# EAGLE design expansion_board (EAGLE 6.6.0)
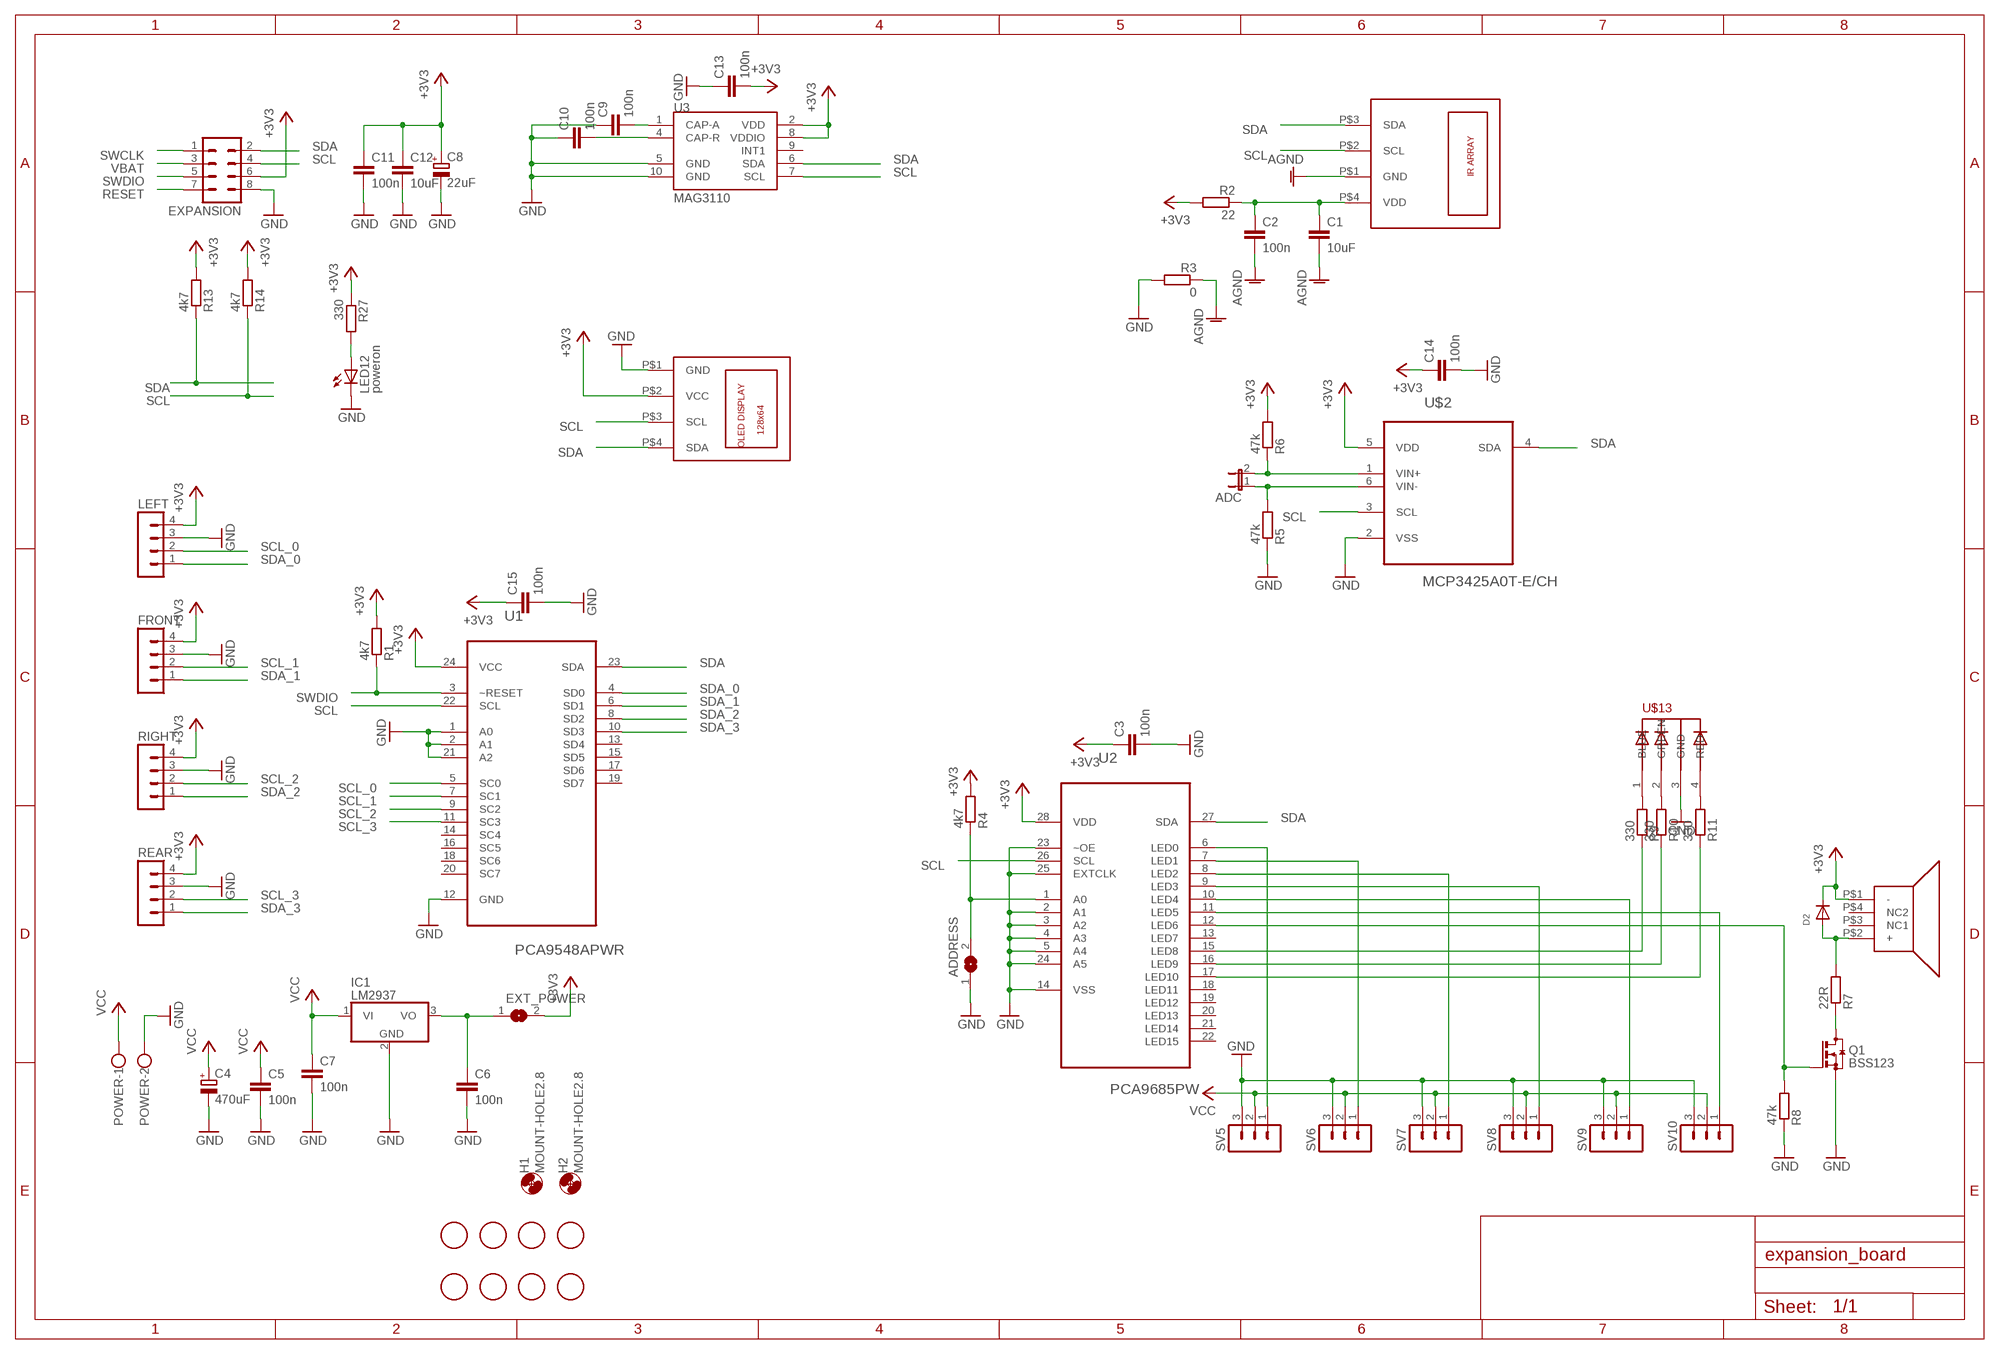
[diagram p0: schematic, sheet 1]

## Parts
ADC  JP1E  [JP1]
ADDRESS  SJ  [SJ]
C1  10uF  C-EUC0805  [C0805]
C2  100n  C-EUC0805  [C0805]
C3  100n  C-EUC0805  [C0805]
C4  470uF  CPOL-EU153CLV-1012  [153CLV-1012]
C5  100n  C-EUC0805  [C0805]
C6  100n  C-EUC0805  [C0805]
C7  100n  C-EUC0805  [C0805]
C8  22uF  CPOL-EU153CLV-0505  [153CLV-0505]
C9  100n  C-EUC0805  [C0805]
C10  100n  C-EUC0805  [C0805]
C11  100n  C-EUC0805  [C0805]
C12  10uF  C-EUC0805  [C0805]
C13  100n  C-EUC0805  [C0805]
C14  100n  C-EUC0805  [C0805]
C15  100n  C-EUC0805  [C0805]
D2  DIODE_SOD-123FL  [SOD-123FL]
EXPANSION  MA04-2  [MA04-2]
EXT_POWER  SJ  [SJ]
FRONT  MA04-1  [MA04-1]
H1  MOUNT-HOLE2.8  [2,8]
H2  MOUNT-HOLE2.8  [2,8]
IC1  LM2937  [TO263-3]
LED12  poweron  LEDCHIPLED_1206  [CHIPLED_1206]
LEFT  MA04-1  [MA04-1]
POWER  W237-102  [W237-102]
Q1  BSS123  [SOT23]
R1  4k7  R-EU_M0805  [M0805]
R2  22  R-EU_M0805  [M0805]
R3  0  R-EU_M0805  [M0805]
R4  4k7  R-EU_M0805  [M0805]
R5  47k  R-EU_M0805  [M0805]
R6  47k  R-EU_M0805  [M0805]
R7  22R  R-EU_M0805  [M0805]
R8  47k  R-EU_M0805  [M0805]
R9  330  R-EU_M0805  [M0805]
R10  330  R-EU_M0805  [M0805]
R11  330  R-EU_M0805  [M0805]
R13  4k7  R-EU_M0805  [M0805]
R14  4k7  R-EU_M0805  [M0805]
R27  330  R-EU_M0805  [M0805]
REAR  MA04-1  [MA04-1]
RIGHT  MA04-1  [MA04-1]
SV5  MA03-1  [MA03-1]
SV6  MA03-1  [MA03-1]
SV7  MA03-1  [MA03-1]
SV8  MA03-1  [MA03-1]
SV9  MA03-1  [MA03-1]
SV10  MA03-1  [MA03-1]
U1  PCA9548APWR  [SOP65P640X120-24N]
U2  PCA9685PW  [SOP65P640X110-28N]
U3  MAG3110  [DFN-10]
U$1  MLX90621  [MLX90621]
U$2  MCP3425A0T-E/CH  [SOT95P270X145-6N]
U$3  SPEAKER_KAAG15008C  [KAAG15008C]
U$4  OLED_DISPLAY_096_INCH  [OLED_DISPLAY_096_INCH]
U$5  FIDUCIAL  [FIDUCIAL_1MM]
U$6  FIDUCIAL  [FIDUCIAL_1MM]
U$7  FIDUCIAL  [FIDUCIAL_1MM]
U$8  FIDUCIAL  [FIDUCIAL_1MM]
U$9  FIDUCIAL  [FIDUCIAL_1MM]
U$10  FIDUCIAL  [FIDUCIAL_1MM]
U$11  FIDUCIAL  [FIDUCIAL_1MM]
U$12  FIDUCIAL  [FIDUCIAL_1MM]
U$13  5MMRGBLED  [LED5MMRGB]

## Nets
+3V3: C3.1 C8.+ C11.1 C12.1 C13.2 C14.1 C15.1 D2.C EXPANSION.6 EXT_POWER.2 FRONT.4 LEFT.4 R1.2 R2.2 R4.2 R6.2 R13.2 R14.2 R27.1 REAR.4 RIGHT.4 U1.24(VCC) U2.28(VDD) U3.2(VDD) U3.8(VDDIO) U$2.5(VDD) U$3.P$1(-) U$4.P$2(VCC)
AGND: C1.2 C2.2 R3.1 U$1.P$1(GND)
GND: ADDRESS.1 C3.2 C4.- C5.2 C6.2 C7.2 C8.- C9.1 C10.1 C11.2 C12.2 C13.1 C14.2 C15.2 EXPANSION.8 FRONT.3 IC1.2(GND) LED12.C LEFT.3 POWER.2 Q1.2(S) R3.2 R5.1 R8.1 REAR.3 RIGHT.3 SV5.3 SV6.3 SV7.3 SV8.3 SV9.3 SV10.3 U1.1(A0) U1.2(A1) U1.12(GND) U1.21(A2) U2.2(A1) U2.3(A2) U2.4(A3) U2.5(A4) U2.14(VSS) U2.23(~OE) U2.24(A5) U2.25(EXTCLK) U3.5(GND) U3.10(GND) U$2.2(VSS) U$4.P$1(GND) U$13.3(GND)
N$1: C1.1 C2.1 R2.1 U$1.P$4(VDD)
N$2: SV5.1 U2.6(LED0)
N$3: SV6.1 U2.7(LED1)
N$4: SV7.1 U2.8(LED2)
N$5: SV8.1 U2.9(LED3)
N$6: SV9.1 U2.10(LED4)
N$7: SV10.1 U2.11(LED5)
N$8: C6.1 EXT_POWER.1 IC1.3(VO)
N$9: ADDRESS.2 R4.1 U2.1(A0)
N$13: C9.2 U3.1(CAP-A)
N$14: C10.2 U3.4(CAP-R)
N$15: ADC.1 R5.2 U$2.6(VIN-)
N$16: ADC.2 R6.1 U$2.1(VIN+)
N$17: R9.2 U$13.1(BLUE)
N$18: Q1.1(G) R8.2 U2.12(LED6)
N$19: Q1.3(D) R7.1
N$20: D2.A R7.2 U$3.P$2(+)
N$21: R11.2 U$13.4(RED)
N$22: R10.2 U$13.2(GREEN)
N$23: LED12.A R27.2
N$24: R9.1 U2.15(LED8)
N$25: R10.1 U2.16(LED9)
N$26: R11.1 U2.17(LED10)
RESET: EXPANSION.7
SCL: EXPANSION.4 R14.1 U1.22(SCL) U2.26(SCL) U3.7(SCL) U$1.P$2(SCL) U$2.3(SCL) U$4.P$3(SCL)
SCL_0: LEFT.2 U1.5(SC0)
SCL_1: FRONT.2 U1.7(SC1)
SCL_2: RIGHT.2 U1.9(SC2)
SCL_3: REAR.2 U1.11(SC3)
SDA: EXPANSION.2 R13.1 U1.23(SDA) U2.27(SDA) U3.6(SDA) U$1.P$3(SDA) U$2.4(SDA) U$4.P$4(SDA)
SDA_0: LEFT.1 U1.4(SD0)
SDA_1: FRONT.1 U1.6(SD1)
SDA_2: RIGHT.1 U1.8(SD2)
SDA_3: REAR.1 U1.10(SD3)
SWCLK: EXPANSION.1
SWDIO: EXPANSION.5 R1.1 U1.3(~RESET)
VBAT: EXPANSION.3
VCC: C4.+ C5.1 C7.1 IC1.1(VI) POWER.1 SV5.2 SV6.2 SV7.2 SV8.2 SV9.2 SV10.2
Unconnected: U1.13(SD4) U1.14(SC4) U1.15(SD5) U1.16(SC5) U1.17(SD6) U1.18(SC6) U1.19(SD7) U1.20(SC7) U2.13(LED7) U2.18(LED11) U2.19(LED12) U2.20(LED13) U2.21(LED14) U2.22(LED15) U3.9(INT1) U$3.P$3(NC1) U$3.P$4(NC2)

## Library data of the parts
ADC = jumper:JP1E: JUMPER
ADDRESS EXT_POWER = jumper:SJ: SMD solder JUMPER
C1-C3 C5-C7 C9-C15 = resistor:C-EU: CAPACITOR, European symbol
C4 C8 = resistor:CPOL-EU: POLARIZED CAPACITOR, European symbol
D2 = adafruit:DIODE: Diode SMADIODE - SMA Surface Mount Package 20V 1A Schottky Diode Digikey: 641-1014-6-ND DO-1N4148 - Through Hole Small Current Diode SOD-123 20V 1 A (.5mV Vf) Schottky Diode - Digikey: MBRX120TPMSCT-ND SOD-323 10V 570mA (.38mV Vf, 3ns) Schottky Diode - Digikey: ZLLS410CT-ND SOD-523 30V 30mA Schottky Diode (RB751S-40TE61) - Digikey: RB751S-40TE61CT-ND SOT23-R/W - SOT23 Package (R = Solder Paste/Reflow Ovens, W = Hand-Soldering) BAT54Film 40V 300mA - Digikey: 497-7162-1-ND
EXPANSION = con-lstb:MA04-2: PIN HEADER; OC_FARNELL: unknown; OC_NEWARK: unknown
FRONT LEFT REAR RIGHT = con-lstb:MA04-1: PIN HEADER; OC_FARNELL: unknown; OC_NEWARK: unknown
H1 H2 = holes:MOUNT-HOLE: MOUNTING HOLE with drill center marker
IC1 = linear:LM2937: LM2937-2.5, LM2937-3.3 400mA and 500mA Voltage Regulators Source: http://cache.national.com/ds/LM/LM2937-2.5.pdf
LED12 = led:LED: LED OSRAM: - CHIPLED LG R971, LG N971, LY N971, LG Q971, LY Q971, LO R971, LY R971 LH N974, LH R974 LS Q976, LO Q976, LY Q976 LO Q996 - Hyper CHIPLED LW Q18S LB Q993, LB Q99A, LB R99A - SideLED LS A670, LO A670, LY A670, LG A670, LP A670 LB A673, LV A673, LT A673, LW A673 LH A674 LY A675 LS A676, LA A676, LO A676, LY A676, LW A676 LS A679, LY A679, LG A679 - Hyper Micro SIDELED® LS Y876, LA Y876, LO Y876, LY Y876 LT Y87S - SmartLED LW L88C, LW L88S LB L89C, LB L89S, LG L890 LS L89K, LO L89K, LY L89K LS L896, LA L896, LO L896, LY L896 - TOPLED LS T670, LO T670, LY T670, LG T670, LP T670 LSG T670, LSP T670, LSY T670, LOP T670, LYG T670 LG T671, LOG T671, LSG T671 LB T673, LV T673, LT T673, LW T673 LH T674 LS T676, LA T676, LO T676, LY T676, LB T676, LH T676, LSB T676, LW T676 LB T67C, LV T67C, LT T67C, LS T67K, LO T67K, LY T67K, LW E67C LS E67B, LA E67B, LO E67B, LY E67B, LB E67C, LV E67C, LT E67C LW T67C LS T679, LY T679, LG T679 LS T770, LO T770, LY T770, LG T770, LP T770 LB T773, LV T773, LT T773, LW T773 LH T774 LS E675, LA E675, LY E675, LS T675 LS T776, LA T776, LO T776, LY T776, LB T776 LHGB T686 LT T68C, LB T68C - Hyper Mini TOPLED® LB M676 - Mini TOPLED Santana® LG M470 LS M47K, LO M47K, LY M47K Source: http://www.osram.convergy.de LUXEON: - LUMILED® LXK2-PW12-R00, LXK2-PW12-S00, LXK2-PW14-U00, LXK2-PW14-V00 LXK2-PM12-R00, LXK2-PM12-S00, LXK2-PM14-U00 LXK2-PE12-Q00, LXK2-PE12-R00, LXK2-PE12-S00, LXK2-PE14-T00, LXK2-PE14-U00 LXK2-PB12-K00, LXK2-PB12-L00, LXK2-PB12-M00, LXK2-PB14-N00, LXK2-PB14-P00, LXK2-PB14-Q00 LXK2-PR12-L00, LXK2-PR12-M00, LXK2-PR14-Q00, LXK2-PR14-R00 LXK2-PD12-Q00, LXK2-PD12-R00, LXK2-PD12-S00 LXK2-PH12-R00, LXK2-PH12-S00 LXK2-PL12-P00, LXK2-PL12-Q00, LXK2-PL12-R00 Source: www.luxeon.com KINGBRIGHT: KA-3528ASYC Source: www.kingbright.com
POWER = con-wago-500:W237-102: WAGO SCREW CLAMP; MPN: 237-102; OC_FARNELL: unknown; OC_NEWARK: 70K9898
Q1 = transistor-small-signal:BSS123: N-CHANNEL MOS FET
R1-R11 R13 R14 R27 = resistor:R-EU_: RESISTOR, European symbol
SV5-SV10 = con-lstb:MA03-1: PIN HEADER; OC_FARNELL: unknown; OC_NEWARK: unknown
U1 = my_parts:PCA9548APWR: 8-CHANNEL I2C SWITCH WITH RESET; MPN: PCA9548APWR False; OC_FARNELL: 1607855; OC_NEWARK: 22M1602; PACKAGE: TSSOP-24; SUPPLIER: Texas Instruments
U2 = my_parts:PCA9685PW: 16-channel, 12-bit PWM Fm+ I2C-bus LED controller; MPN: PCA9685PW; OC_FARNELL: 1854074; OC_NEWARK: 19T6398; PACKAGE: TSSOP-28; SUPPLIER: NXP
U3 = SparkFun-Sensors:MAG3110: 3-axis digital (I2C) magnetometer
U$1 = my_parts:MLX90621
U$2 = my_parts:MCP3425A0T-E/CH: Analog-to-Digital Converter; MPN: MCP3425A0T-E/CH; OC_FARNELL: 1578433; OC_NEWARK: 88M9948; PACKAGE: SOT-6; SUPPLIER: Microchip
U$3 = my_parts:SPEAKER_KAAG15008C
U$4 = my_parts:OLED_DISPLAY_096_INCH
U$5-U$12 = adafruit:FIDUCIAL: For use by pick and place machines to calibrate the vision/machine, 1mm By microbuilder.eu
U$13 = adafruit:5MMRGBLED

## Board
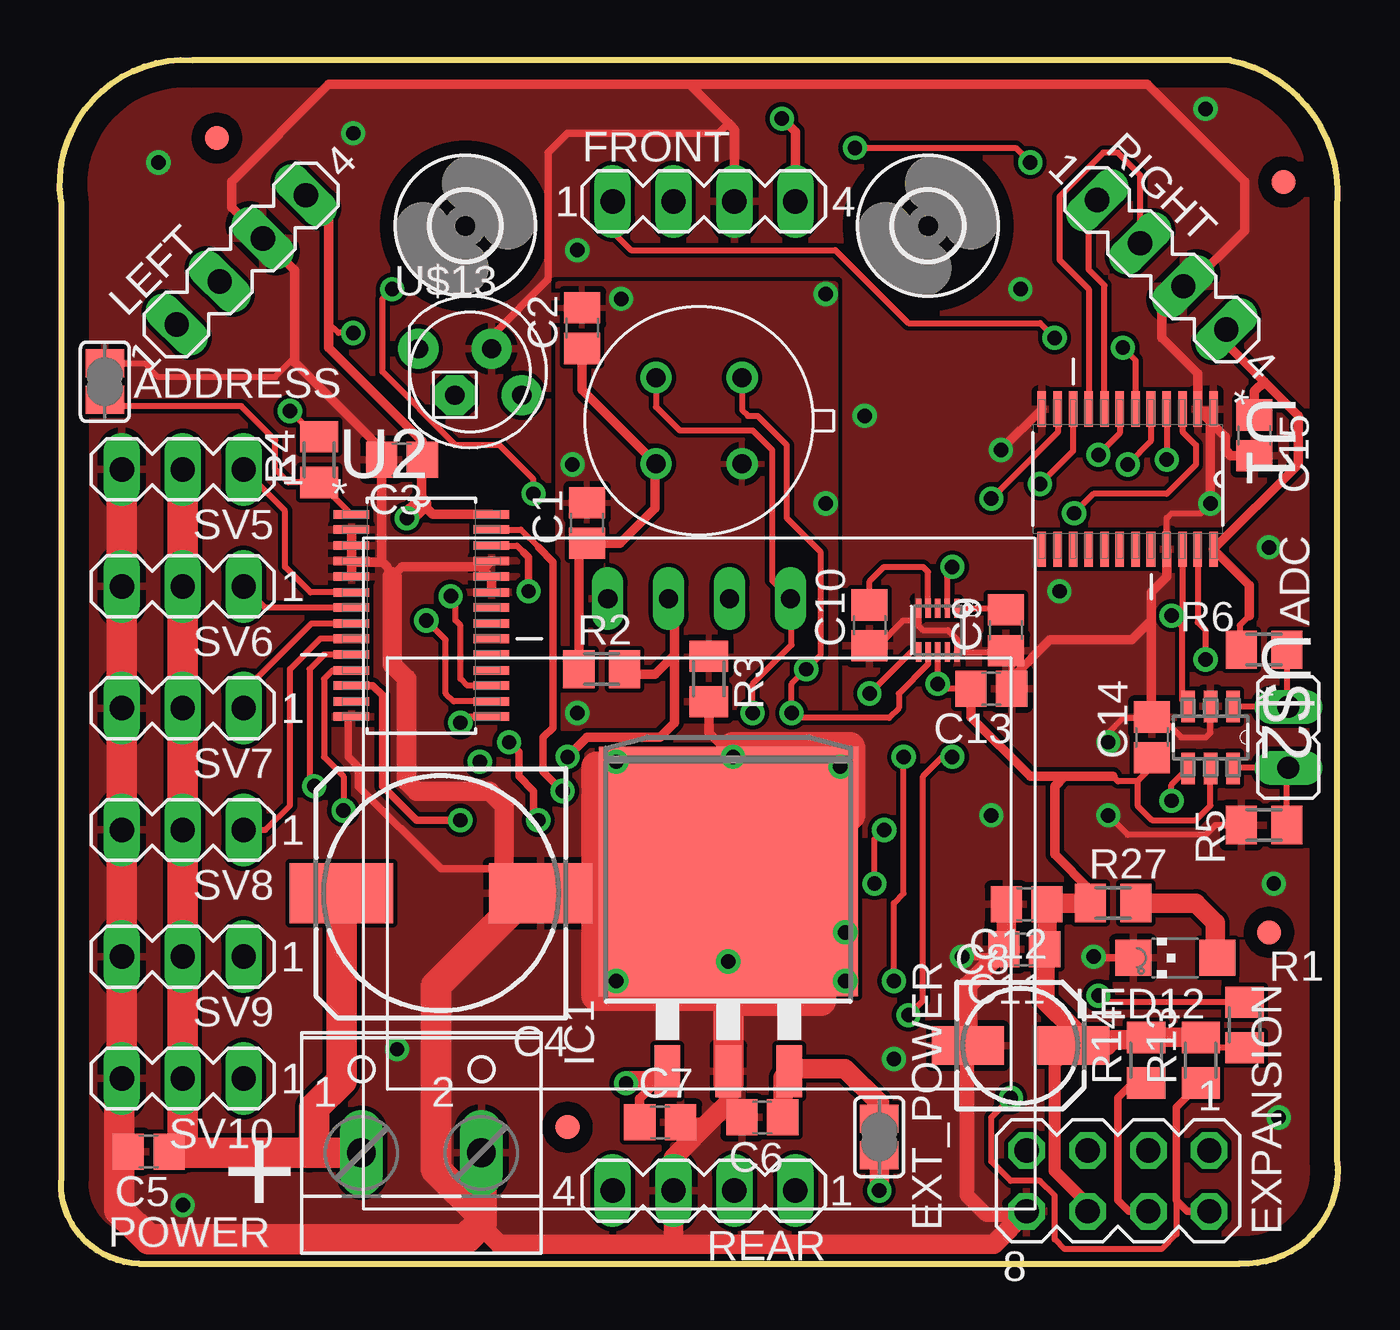
[diagram p1: board, top side]
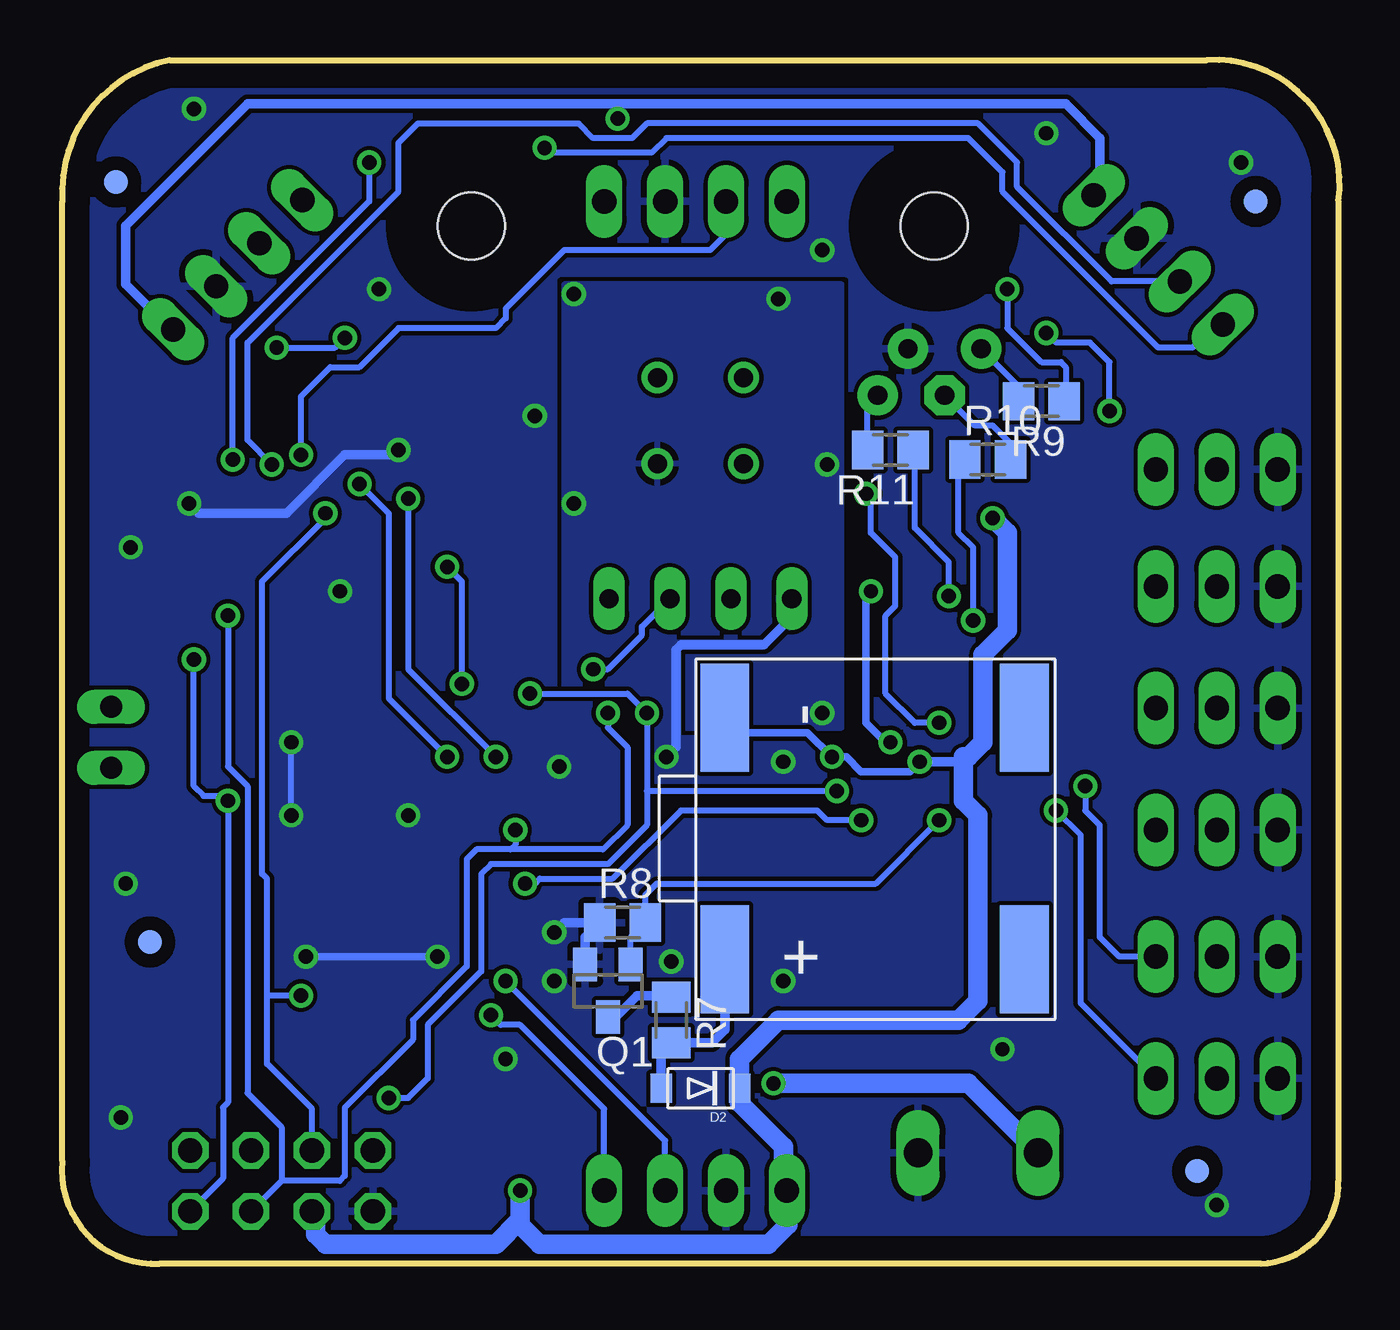
[diagram p2: board, bottom side, seen from below]

Size 53.3 x 50.2 mm. Coordinates in mm from the lower left corner, seen from the top.
Outline: 3.29,0 49.22,0 arc99 53.28,4.27 53.28,44.3 arc82 48.81,50.19 5.53,50.19 arc101 0.04,44.3 0.04,3.46 arc90 3.29,0
Copper layers (1*16): Top 0.035mm / dielectric 1.5mm / Bottom 0.035mm
Design rules "default *": minimum track width 7mil, minimum drill 24mil, track to track 7mil, track to pad 7mil, pad to pad 7mil, via to via 7mil, smd to smd 7mil, copper to edge 40mil, drill to drill 8mil, minimum pad ring 10mil, minimum via ring 8mil, stop-mask expansion 4mil, vias tented up to drill 0mil, thermal gap 10mil

### Footprints (pad centres in the part's own frame; a part is rotated, then mirrored left to right if it is on the bottom)
JP1 = drill 0.914 long: 1 0,-1.27; 2 0,1.27
SJ = smd 1.168 x 1.6: 1 -0.762,0; 2 0.762,0
C0805 = smd 1.3 x 1.5: 1 -0.85,0; 2 0.85,0
153CLV-1012 = smd 4.3 x 2.5: + 4.15,0; - -4.15,0
153CLV-0505 = smd 3 x 1.6: + 2.2,0; - -2.2,0
SOD-123FL = smd 0.91 x 1.22: A 1.637,0; C -1.637,0
MA04-2 = drill 1.016 octagon: 1 -3.81,-1.27; 2 -3.81,1.27; 3 -1.27,-1.27; 4 -1.27,1.27; 5 1.27,-1.27; 6 1.27,1.27; 7 3.81,-1.27; 8 3.81,1.27
MA04-1 = drill 1.016 long: 1 -3.81,0; 2 -1.27,0; 3 1.27,0; 4 3.81,0
2,8 = hole 2.8: 0,0
TO263-3 = smd 1.067 x 2.159: 1 -2.54,-5.791; 2 0,-5.791; 3 2.54,-5.791 | smd 10.8 x 10.41: TAB 0,2.54
CHIPLED_1206 = smd 1.5 x 1.5: A 0,-1.75; C 0,1.75
W237-102 = drill 1.194 long: 1 -2.5,-1.27; 2 2.5,-1.27
SOT23 = smd 1 x 1.4: 1 -0.95,-1.1; 2 0.95,-1.1; 3 0,1.1
M0805 = smd 1.3 x 1.6: 1 -0.95,0; 2 0.95,0
MA03-1 = drill 1.016 long: 1 -2.54,0; 2 0,0; 3 2.54,0
SOP65P640X120-24N = smd 1.473 x 0.356: 1 -2.921,3.581; 2 -2.921,2.921; 3 -2.921,2.286; 4 -2.921,1.626; 5 -2.921,0.965; 6 -2.921,0.33; 7 -2.921,-0.33; 8 -2.921,-0.965; 9 -2.921,-1.626; 10 -2.921,-2.286; 11 -2.921,-2.921; 12 -2.921,-3.581; 13 2.921,-3.581; 14 2.921,-2.921; 15 2.921,-2.286; 16 2.921,-1.626; 17 2.921,-0.965; 18 2.921,-0.33; 19 2.921,0.33; 20 2.921,0.965; 21 2.921,1.626; 22 2.921,2.286; 23 2.921,2.921; 24 2.921,3.581
SOP65P640X110-28N = smd 1.473 x 0.356: 1 -2.921,4.216; 2 -2.921,3.581; 3 -2.921,2.921; 4 -2.921,2.286; 5 -2.921,1.626; 6 -2.921,0.965; 7 -2.921,0.33; 8 -2.921,-0.33; 9 -2.921,-0.965; 10 -2.921,-1.626; 11 -2.921,-2.286; 12 -2.921,-2.921; 13 -2.921,-3.581; 14 -2.921,-4.216; 15 2.921,-4.216; 16 2.921,-3.581; 17 2.921,-2.921; 18 2.921,-2.286; 19 2.921,-1.626; 20 2.921,-0.965; 21 2.921,-0.33; 22 2.921,0.33; 23 2.921,0.965; 24 2.921,1.626; 25 2.921,2.286; 26 2.921,2.921; 27 2.921,3.581; 28 2.921,4.216
DFN-10 = smd 0.8 x 0.22: 1 -0.91,0.8; 2 -0.91,0.4; 3 -0.91,0; 4 -0.91,-0.4; 5 -0.91,-0.8; 6 0.91,-0.8; 7 0.91,-0.4; 8 0.91,0; 9 0.91,0.4; 10 0.91,0.8
MLX90621 = drill 0.8: P$1 2.54,0; P$2 0,2.54; P$3 -2.54,0; P$4 0,-2.54
SOT95P270X145-6N = smd 1.321 x 0.559: 1 -1.295,0.94; 2 -1.295,0; 3 -1.295,-0.94; 4 1.295,-0.94; 5 1.295,0; 6 1.295,0.94
KAAG15008C = smd 4.5 x 2.037: P$1 2.438,1.219; P$2 12.497,1.219; P$3 12.497,13.716; P$4 2.438,13.716
OLED_DISPLAY_096_INCH = drill 0.8 long: P$1 -3.81,10.46; P$2 -1.27,10.46; P$3 1.27,10.46; P$4 3.81,10.46
FIDUCIAL_1MM = smd 1 x 1: 1 0,0
LED5MMRGB = drill 0.8 pad 1.676: 1 -2.159,0.968; 3 0.889,0.968; 4 2.159,-0.968 | drill 0.8 pad 1.676 octagon: 2 -0.635,-0.968

### Placement (x,y rotation side)
ADC  51.25,21.95 0 top
ADDRESS  1.87,36.78 270 top
C1  21.99,30.89 90 top
C2  21.79,39.02 90 top
C3  14.27,33.53 180 top
C4  15.89,15.45 180 top
C5  3.7,4.68 180 top
C6  29.3,6.1 180 top
C7  25.04,5.9 0 top
C8  40.07,9.1 0 top
C9  39.46,26.42 90 top
C10  33.78,26.62 90 top
C11  40.23,13.11 180 top
C12  40.33,14.99 180 top
C13  38.86,23.98 180 top
C14  45.56,21.95 90 top
C15  49.83,34.55 270 top
D2  26.66,7.32 180 bottom
EXPANSION  44.14,3.46 180 top
EXT_POWER  34.18,5.29 270 top
FRONT  26.87,44.3 0 top
H1  36.21,43.28 0 top
H2  16.91,43.28 0 top
IC1  27.88,13.82 0 top
LED12  46.53,12.75 90 top
LEFT  7.56,41.86 45 top
POWER  15.08,5.9 0 top
Q1  30.52,11.38 180 bottom
R1  49.42,9.96 270 top
R2  22.6,24.79 0 top
R3  27.07,24.39 270 top
R4  10.81,33.53 90 top
R5  50.23,18.29 0 top
R6  50.23,25.61 180 top
R7  27.88,10.16 270 bottom
R8  29.91,14.23 0 bottom
R9  12.44,35.97 180 bottom
R10  14.67,33.53 0 bottom
R11  18.74,33.94 180 bottom
R13  47.59,8.49 90 top
R14  45.31,8.49 90 top
R27  43.94,15.04 0 top
REAR  26.87,3.05 180 top
RIGHT  45.97,41.66 315 top
SV5  5.12,33.12 180 top
SV6  5.12,28.25 180 top
SV7  5.12,23.17 180 top
SV8  5.12,18.09 180 top
SV9  5.12,12.8 180 top
SV10  5.12,7.72 180 top
U1  44.54,32.72 270 top
U2  15.08,27.03 0 top
U3  36.62,26.42 270 top
U$1  26.66,35.16 315 top
U$2  48,21.95 270 top
U$3  26.87,25.2 270 bottom
U$4  26.66,17.27 0 top
U$5  21.18,5.69 0 top
U$6  6.55,46.94 0 top
U$7  50.44,13.82 0 top
U$8  51.05,45.11 0 top
U$9  51.05,45.11 0 bottom
U$10  3.5,44.3 0 bottom
U$11  49.62,13.41 0 bottom
U$12  5.94,3.86 0 bottom
U$13  17.11,37.19 0 top

### Tracks (layer width: path | path; a pad name or v marks a point on that pad's centre or on a via)
+3V3  (via drill 0.6)
  Top 0.254: R4.2 10.68,34.48 v9.59,35.56 | 48,21.14 U$2.5 48,19.1 47.39,18.49 45.56,18.49 44.95,19.1 44.95,20.12 | 49.62,27.03 49.22,26.62 49.22,25.67 R6.2 | U3.2 37.02,28.85 v37.23,29.06 | U3.8 v36.62,24.18 36.82,23.98 C13.2 | R1.2 48.02,9.01 R13.2 | C14.1 45.56,20.73 44.95,20.12 | 44.95,20.12 44.14,20.12 43.93,20.32 | v12.24,38.81 11.63,38.81 11.22,39.22
  Top 0.406: U2.28 15.54,31.24 15.08,31.7 15.08,33.49 C3.1 15.12,34.31 11.22,38.2 11.22,39.22 11.22,43.59 LEFT.4 | v21.18,21.14 21.99,21.95 25.04,21.95 25.65,22.56 25.65,25.4 | FRONT.4 30.68,47.2 v30.12,47.75 | 49.62,27.03 49.62,28.3 U1.24 51.66,33.33 51.66,35.36 50.23,36.78 | RIGHT.4 48.66,38.35 50.23,36.78 | C15.1 49.83,36.38 50.23,36.78 | C13.2 38,22.8 40.48,20.32 41.9,20.32 | 43.93,20.32 41.9,20.32 | R27.1 42.98,15.58 41.5,17.07 41.5,19.92 41.9,20.32 | 25.65,25.4 25.65,27.48 U$4.P$2 | 25.65,25.4 24.83,24.59 23.75,24.59 R2.2
  Top 0.508: EXPANSION.6 42.87,2.49 41.5,3.86 41.5,8.32 C8.+
  Top 0.813: R13.2 R14.2 45.22,9.35 43.93,9.35 43.68,9.1 C8.+ 42.27,9.79 41.09,10.98 41.09,13.1 C11.1 41.18,13.21 C12.1 41.23,15.04 R27.1 | v34.18,3.05 EXT_POWER.2 | v14.47,31.09 15.08,31.7
  Bottom 0.254: v37.23,29.06 36.62,28.45 v36.62,24.18 | v9.59,35.56 9.59,37.59 10.41,38.41 11.83,38.41 v12.24,38.81
  Bottom 0.305: v17.52,20.93 17.93,20.53 19.96,20.53 20.57,21.14 v21.18,21.14 22.19,22.15 25.24,22.15 25.65,22.56 U$3.P$1
  Bottom 0.406: 30.12,48.36 45.56,48.36 50.64,43.28 50.64,40.85 48.76,38.96 RIGHT.4 | 30.12,48.36 11.42,48.36 10,46.94 10,44.81 LEFT.4 | v30.12,47.75 30.12,48.36 | v17.52,20.93 15.89,20.93 15.69,21.14 | D2.C 25.03,8.32 25.04,8.33
  Bottom 0.813: EXPANSION.6 42.72,2.03 42.72,1.22 42.31,0.82 35.2,0.82 34.18,1.83 v34.18,3.05 34.18,1.63 33.37,0.82 23.82,0.82 23.01,1.63 23.01,3 REAR.4 23.21,3.2 23.21,4.88 25.04,6.71 25.04,8.33 25.04,8.54 23.41,10.16 15.89,10.16 15.08,10.98 15.08,18.7 15.69,19.31 15.69,21.14 15.49,21.14 14.88,21.74 14.88,25.4 13.86,26.42 13.86,30.48 v14.47,31.09
AGND  (via drill 0.6)
  other vias: 21.58,22.96 23.41,40.24 31.95,40.44 21.38,33.33 31.95,31.7
  pour Top: 20.77,22.35 32.35,22.35 32.35,40.85 20.77,40.85
  pour Bottom: 20.77,40.85 32.35,40.85 32.35,22.35 20.77,22.35
GND  (via drill 0.6)
  Top 0.254: ADDRESS.1 3.55,37.54 4.11,36.98 8.98,36.98 9.8,37.8 | U$2.2 48,22.15 47.8,21.95 46.78,21.95 45.93,22.8 C14.2 45.52,22.76 44.34,22.76 43.73,22.15 v43.73,21.74 | U3.5 35.82,26.82 | 35.82,26.82 35.82,26.61 36.01,26.42 37.03,26.42 37.43,26.01 U3.10 39.4,25.51 C9.1 39.7,25.33 C13.1 | C10.1 34.14,25.77 35.2,26.82 35.82,26.82 | U1.21 46.17,31.09 46.37,31.3 47.59,31.3 v48,31.7 | U1.2 U1.1 | R5.1 48.2,18.29 47.8,17.88 44.54,17.88 v43.73,18.7
  Top 0.305: LED12.C 43.17,12.75 v43.12,12.8 | v37.64,12.8 39.07,12.8 C11.2 | C4.- 19.03,16.46 15.89,16.46 12.44,19.92 12.44,20.73 12.03,21.14 12.03,22.68 U2.14 | 23.21,17.68 v23.21,20.93 | U$13.3 18,38.69 20.36,41.05 20.36,46.33 21.18,47.14 27.48,47.14 27.88,47.55
  Top 0.406: 17.52,29.06 17.75,29.06 U2.25 | 17.52,29.06 17.93,28.65 U2.24 U2.23 | U2.5 U2.4 | 13.66,29.06 13.45,29.26 | 13.45,29.26 12.21,29.26 U2.4 | U2.4 U2.3 U2.2 | 13.45,29.26 13.42,29.3 C3.2 13.42,33.97 9.8,37.59 9.8,37.8 9.8,41.42 LEFT.3 7.16,44.06 7.16,45.11 11.22,49.18 26.26,49.18 | FRONT.3 28.14,47.3 27.88,47.55 26.26,49.18 | 26.26,49.18 45.36,49.18 49.42,45.11 49.42,43.08 47.1,40.76 RIGHT.3 45.97,39.86 45.97,38.61 47.47,37.11 U1.2 48.61,34.5 48.61,33.94 48.85,33.7 C15.2 | C7.2 27.07,5.9 27.27,6.1 | U1.12 v39.26,33.94 | v48,31.7 48,35.51 U1.1 | 45.52,22.76 45.52,26.82 | 45.52,26.82 45.52,28.01 46.17,28.65 U1.21 | C13.1 39.7,24.42 41.29,26.01 44.71,26.01 45.52,26.82 | v23.21,20.93 24.43,19.71 27.07,19.71 27.48,20.12 27.48,20.73 27.48,21.14 v28.09,21.14 27.07,22.15 R3.2 | v27.88,12.6 31.54,12.6 v32.76,13.82 | 14.06,28.86 14.27,29.06 17.52,29.06
  Top 0.61: 27.48,13.01 v27.88,12.6 | 37.84,9.06 37.84,2.85 38.65,2.03 40.18,2.03 EXPANSION.8
  Top 0.813: 37.84,9.06 C8.- 37.87,11.61 C11.2 39.48,13.21 C12.2 | 17.58,2.03 17.58,1.57 18.33,0.82 25.44,0.82 | 25.44,0.82 38.96,0.82 EXPANSION.8 | 25.44,0.82 25.6,0.97 REAR.3 25.6,4.42 27.27,6.1 27.88,6.71 | IC1.2 27.88,7.52 27.88,6.71 | 27.88,6.71 27.88,6.67 C6.2 | 19.55,15.45 18.53,16.46 18.53,19.1 17.93,19.71 14.88,19.71 14.47,20.12 14.47,24.39 13.86,25 13.86,28.65
  Top 1.27: POWER.2 17.58,2.03 | 17.58,2.03 17.58,1.69 16.91,1.02 3.7,1.02 2.48,2.24 2.48,4.27 | 2.48,4.27 2.48,7.62 SV10.3 SV9.3 SV8.3 SV7.3 SV6.3 SV5.3 | C5.2 2.85,4.64 2.48,4.27 | C4.- 19.55,15.45 15.69,11.58 15.69,3.92 17.58,2.03 | v27.88,12.6 27.88,11.18 22.4,11.18 22.4,20.73 27.48,20.73 | 27.48,20.73 31.74,20.73 31.74,10.98 27.88,10.98 27.88,7.52 | v28.09,21.14 28.09,21.54 32.96,21.54 32.96,18.7 27.48,18.7 27.48,20.73
  Bottom 0.254: v43.73,18.7 v43.73,21.74
  Bottom 0.305: v43.12,12.8 v37.64,12.8 | 23.41,20.73 v23.21,20.93
  Bottom 0.406: v48,31.7 47.59,31.3 43.93,31.3 41.5,33.73 39.46,33.73 v39.26,33.94 | U$4.P$1 22.85,26.98 24.02,25.81 27.48,25.81 27.68,25.61 27.68,21.54 v28.09,21.14 | v32.76,13.82 32.35,14.23 R8.1 31.47,13.62 Q1.2
  other vias: 33.57,35.36 38.86,18.7 5.12,2.44 50.84,6.1 50.44,29.87 21.58,42.27 12.24,47.14 4.11,45.93 47.8,48.16 50.64,15.85 23.21,11.79 32.76,11.79 32.56,20.73 34.79,8.54 14.06,8.94 41.7,28.04 40.07,40.64
  pour Bottom (rank 2): -8.29,55.07 62.63,55.07 62.63,-10.36 -8.29,-10.36
  pour Top (rank 2): -7.47,55.88 57.55,55.88 57.55,-3.86 -7.47,-3.86
N$1
  Top 0.406: C2.1 21.79,36.44 U$1.P$4 24.83,33.33 24.83,31.5 23.37,30.04 C1.1 21.65,29.7 R2.1
N$2
  Top 0.254: U2.6 10.46,27.99 9.39,29.06 9.39,31.4 SV5.1
N$3
  Top 0.254: U2.7 8.55,27.36 SV6.1
N$4
  Top 0.254: SV7.1 7.66,23.88 10.48,26.7 U2.8
N$5
  Top 0.254: SV8.1 8.58,18.09 9.59,19.1 9.59,24.79 10.86,26.06 U2.9
N$6  (via drill 0.6)
  Top 0.254: U2.10 11.02,25.4 10.41,24.79 10.41,20.12 v10.61,19.92
  Bottom 0.254: SV9.1 9.19,12.8 10,13.62 10,18.29 10.61,18.9 v10.61,19.92
N$7  (via drill 0.6)
  Top 0.254: U2.11 11.37,24.74 11.02,24.39 11.02,21.14 11.83,20.32 v11.83,18.9
  Bottom 0.254: v11.83,18.9 10.81,17.88 10.81,10.87 SV10.1
N$8
  Top 0.813: C6.1 30.15,7.76 IC1.3 30.52,8.13 32.76,8.13 34.18,6.71 EXT_POWER.1
N$9
  Top 0.254: U2.1 12.15,31.24 R4.1 9.53,32.58 8.98,33.12 8.98,34.34 7.56,35.77 2.13,35.77 ADDRESS.2
N$13
  Top 0.254: U3.1 39.4,27.33 C9.2
N$14
  Top 0.254: C10.2 33.77,28.45 34.38,29.06 36.01,29.06 36.22,28.85 U3.4
N$15
  Top 0.254: R5.2 51.18,20.61 ADC.1 48.96,20.68 U$2.6
N$16
  Top 0.254: U$2.1 51.22,23.24 ADC.2 51.18,23.28 R6.1
N$17
  Bottom 0.254: R9.2 13.39,36.59 U$13.1
N$18  (via drill 0.6)
  Top 0.305: U2.12 13.05,24.11 13.45,23.7 13.45,19.92 14.88,18.49 v16.71,18.49
  Bottom 0.254: 16.98,18.22 v16.71,18.49 19.35,15.85 28.49,15.85 28.96,15.38 R8.2 29.57,13.62 Q1.1
N$19
  Bottom 0.406: Q1.3 30.2,10.28 29.3,11.18 27.95,11.18 R7.1
N$20
  Bottom 0.305: 26.17,12.18 U$3.P$2
  Bottom 0.406: R7.2 26.19,9.21 25.65,9.76 U$3.P$2 | 27.46,8.79 R7.2 | D2.A 28.3,8.79 R7.2
N$21
  Bottom 0.254: R11.2 19.69,35.8 U$13.4
N$22
  Bottom 0.254: R10.2 13.72,34.21 14.47,34.95 15.21,34.95 U$13.2
N$23
  Top 0.813: R27.2 47.39,15.04 48.2,14.23 48.2,12.83 LED12.A
N$24  (via drill 0.6)
  Top 0.254: U2.15 16.96,22.81 v16.71,22.56 | v19.75,32.11 19.75,32.72 18.33,34.14 16.5,34.14 13.45,37.19 13.45,40.24 v13.86,40.64
  Bottom 0.254: v16.71,22.56 17.72,22.56 18.94,23.78 18.94,27.03 18.53,27.43 18.53,29.47 19.55,30.48 19.55,31.9 v19.75,32.11 | v13.86,40.64 13.86,39.02 12.44,37.59 11.63,37.59 11.42,37.39 11.42,36.03 R9.1
N$25  (via drill 0.6)
  Top 0.254: U2.16 16.43,23.45 16.1,23.78 16.1,26.01 v15.28,26.82
  Bottom 0.254: v15.28,26.82 15.28,29.87 15.89,30.48 15.89,33.26 R10.1
N$26  (via drill 0.6)
  Top 0.254: U2.17 16.99,24.11 16.71,24.39 16.71,26.62 16.5,26.82 16.5,27.64 v16.3,27.84
  Bottom 0.254: v16.3,27.84 16.3,29.26 17.72,30.69 17.72,33.87 R11.1
SCL  (via drill 0.6)
  Top 0.254: U$1.P$2 28.46,35.6 28.69,35.36 29.1,35.36 30.32,34.14 30.32,31.09 31.74,29.67 31.74,25.4 v31.13,24.79 | U2.26 19.07,29.95 19.35,29.67 | 19.75,18.7 v19.96,18.49 | v33.98,15.85 33.98,17.68 v34.38,18.09 | U3.7 36.22,25 34.99,23.78 34.99,23.17 34.59,22.76 30.73,22.76 v30.52,22.96 30.52,24.18 v31.13,24.79 | U1.22 46.83,26.57 | U$2.3 46.83,23.47 46.83,26.57 | 46.83,26.57 v46.37,27.03 | 30.93,24.79 v31.13,24.79
  Top 0.305: EXPANSION.4 44.6,2.19 44.14,2.64 44.14,6.91 44.75,7.52 45.29,7.52 R14.1 | 19.75,18.7 19.75,19.71 19.14,20.32 19.14,21.34 v18.74,21.74 | v19.55,28.04 19.55,29.47 19.35,29.67
  Bottom 0.254: v30.52,22.96 30.52,22.35 29.71,21.54 29.71,18.29 30.73,17.27 34.59,17.27 | 34.59,17.27 36.01,17.27 36.42,16.87 36.42,12.4 38.65,10.16 38.65,9.35 41.5,6.5 41.5,3.66 41.7,3.46 44.14,3.46 | v19.96,18.49 21.38,18.49 21.79,18.9 27.48,18.9 30.32,16.06 33.37,16.06 33.57,15.85 v33.98,15.85 | v34.38,18.09 34.38,17.48 34.59,17.27 | 44.14,3.46 EXPANSION.4 | v46.37,27.03 46.37,20.73 45.56,19.92 45.56,7.11 44.14,5.69 44.14,3.46 | v31.13,24.79 30.52,24.79 29.1,26.22 29.1,26.57 U$4.P$3
  Bottom 0.305: v18.74,21.74 18.94,21.74 19.75,22.56 19.75,27.84 v19.55,28.04
SCL_0  (via drill 0.6)
  Top 0.254: U1.5 45.51,34.29 v44.54,33.33
  Bottom 0.254: LEFT.2 9.51,40.96 13.45,44.91 13.45,45.93 15.08,47.55 28.9,47.55 29.51,46.94 31.13,46.94 31.74,47.55 38.45,47.55 39.26,46.74 39.26,44.71 45.56,38.41 45.56,34.34 v44.54,33.33
SCL_1  (via drill 0.6)
  Top 0.254: U1.7 44.21,34.62 v43.33,33.73
  Bottom 0.254: FRONT.2 25.6,42.93 26.26,42.27 32.35,42.27 34.79,39.83 34.79,39.42 35.2,39.02 39.26,39.02 40.89,37.39 42.11,37.39 43.33,36.17 v43.33,33.73
SCL_2
  Top 0.254: RIGHT.2 45.07,45.4 44.14,46.33 43.53,46.33 41.7,44.5 41.7,41.86 42.92,40.64 U1.9
SCL_3  (via drill 0.6)
  Top 0.254: v34.79,11.79 34.79,15.04 35.2,15.45 v35.2,21.14 | U1.11 41.62,34.67 v38.85,31.9
  Bottom 0.254: REAR.2 28.14,5.13 v34.79,11.79 | v38.85,31.9 38.85,24.79 v35.2,21.14
SDA  (via drill 0.6)
  Top 0.254: U$1.P$3 24.87,35.73 25.85,34.75 28.9,34.75 29.71,33.94 29.71,28.5 U$4.P$4 30.52,27.68 30.52,25.81 28.9,24.18 v28.9,22.96 | U2.27 19.22,30.61 19.96,29.87 | U3.6 35.51,25.51 v33.77,23.78 | 46.58,6.52 46.58,1.22 45.97,0.61 41.9,0.61 41.5,1.02 41.5,2.85 40.89,3.46 39.67,3.46 38.85,4.27 38.85,6.1 v39.67,6.91 | v47.8,25.2 47.8,26.42 47.47,26.75 U1.23 | v46.37,19.31 46.37,19.97 U$2.4
  Top 0.305: EXPANSION.2 47.03,2.19 46.58,2.64 46.58,6.52 R13.1 | v20.97,19.71 20.16,20.53 20.16,21.95 20.57,22.35 20.57,29.26 19.96,29.87
  Bottom 0.254: 28.9,19.71 v28.9,22.96 29.71,23.78 v33.77,23.78 | 28.9,19.71 28.9,18.29 30.52,16.66 35.4,16.66 35.81,16.26 35.81,12.19 38.04,9.96 38.04,7.72 38.85,6.91 v39.67,6.91 | v20.97,19.71 28.9,19.71 | v47.8,25.2 47.8,19.92 47.39,19.51 46.58,19.51 v46.37,19.31 46.37,6.72 46.58,6.52 46.58,3.56 EXPANSION.2
SDA_0  (via drill 0.6)
  Top 0.254: U1.4 v46.17,33.53 | v33.17,46.54 39.87,46.54 v40.48,45.93
  Bottom 0.254: LEFT.1 5.18,39.17 6.14,38.2 7.56,38.2 14.06,44.71 14.06,45.52 15.49,46.94 28.09,46.94 28.69,46.33 32.96,46.33 v33.17,46.54 | v46.17,33.53 46.17,38.61 40.48,44.3 v40.48,45.93
SDA_1  (via drill 0.6)
  Top 0.254: FRONT.1 23.06,43.03 23.82,42.27 32.35,42.27 35.4,39.22 40.89,39.22 v41.5,38.61 | U1.6 44.87,37.67 v44.34,38.2
  Bottom 0.254: v44.34,38.2 41.9,38.2 v41.5,38.61
SDA_2
  Top 0.254: U1.8 43.58,40.79 42.92,41.46 42.92,44 RIGHT.1
SDA_3  (via drill 0.6)
  Top 0.254: v35.4,10.37 36.01,10.98 36.01,20.32 36.82,21.14 v37.23,21.14 | U1.10 42.26,33.89 v40.89,32.51
  Bottom 0.254: REAR.1 30.68,6.45 34.18,9.96 34.99,9.96 v35.4,10.37 | v40.89,32.51 39.67,31.3 39.67,23.57 v37.23,21.14
SWDIO  (via drill 0.6)
  Top 0.254: R1.1 43.59,10.91 v43.33,11.18 | U1.3 46.83,34.7 47.39,34.14 47.39,33.33 46.17,32.11 43.12,32.11 v42.31,31.3
  Bottom 0.254: EXPANSION.5 42.87,6.45 44.75,8.33 44.75,11.18 | v43.33,11.18 44.75,11.18 | v42.31,31.3 42.31,31.09 44.95,28.45 44.95,16.26 44.75,16.06 44.75,11.18
VCC  (via drill 0.6)
  Top 0.406: C7.1 24.19,6.87 24.94,7.62
  Top 0.813: v23.61,7.52 23.72,7.62 24.94,7.62 IC1.1
  Top 1.27: SV5.2 SV6.2 SV7.2 SV8.2 SV9.2 SV10.2 5.12,4.83 5.33,4.63 | POWER.1 10.41,4.63 | 10.41,4.63 5.33,4.63 | 5.33,4.63 4.6,4.63 C5.1 | C4.+ 11.74,7.64 10.61,6.5 10.61,4.83 10.41,4.63
  Bottom 0.813: v23.61,7.52 15.48,7.52 POWER.1

### Text on the board
tNames: +